# EAGLE design PogoFTDI (EAGLE 7.6.0)
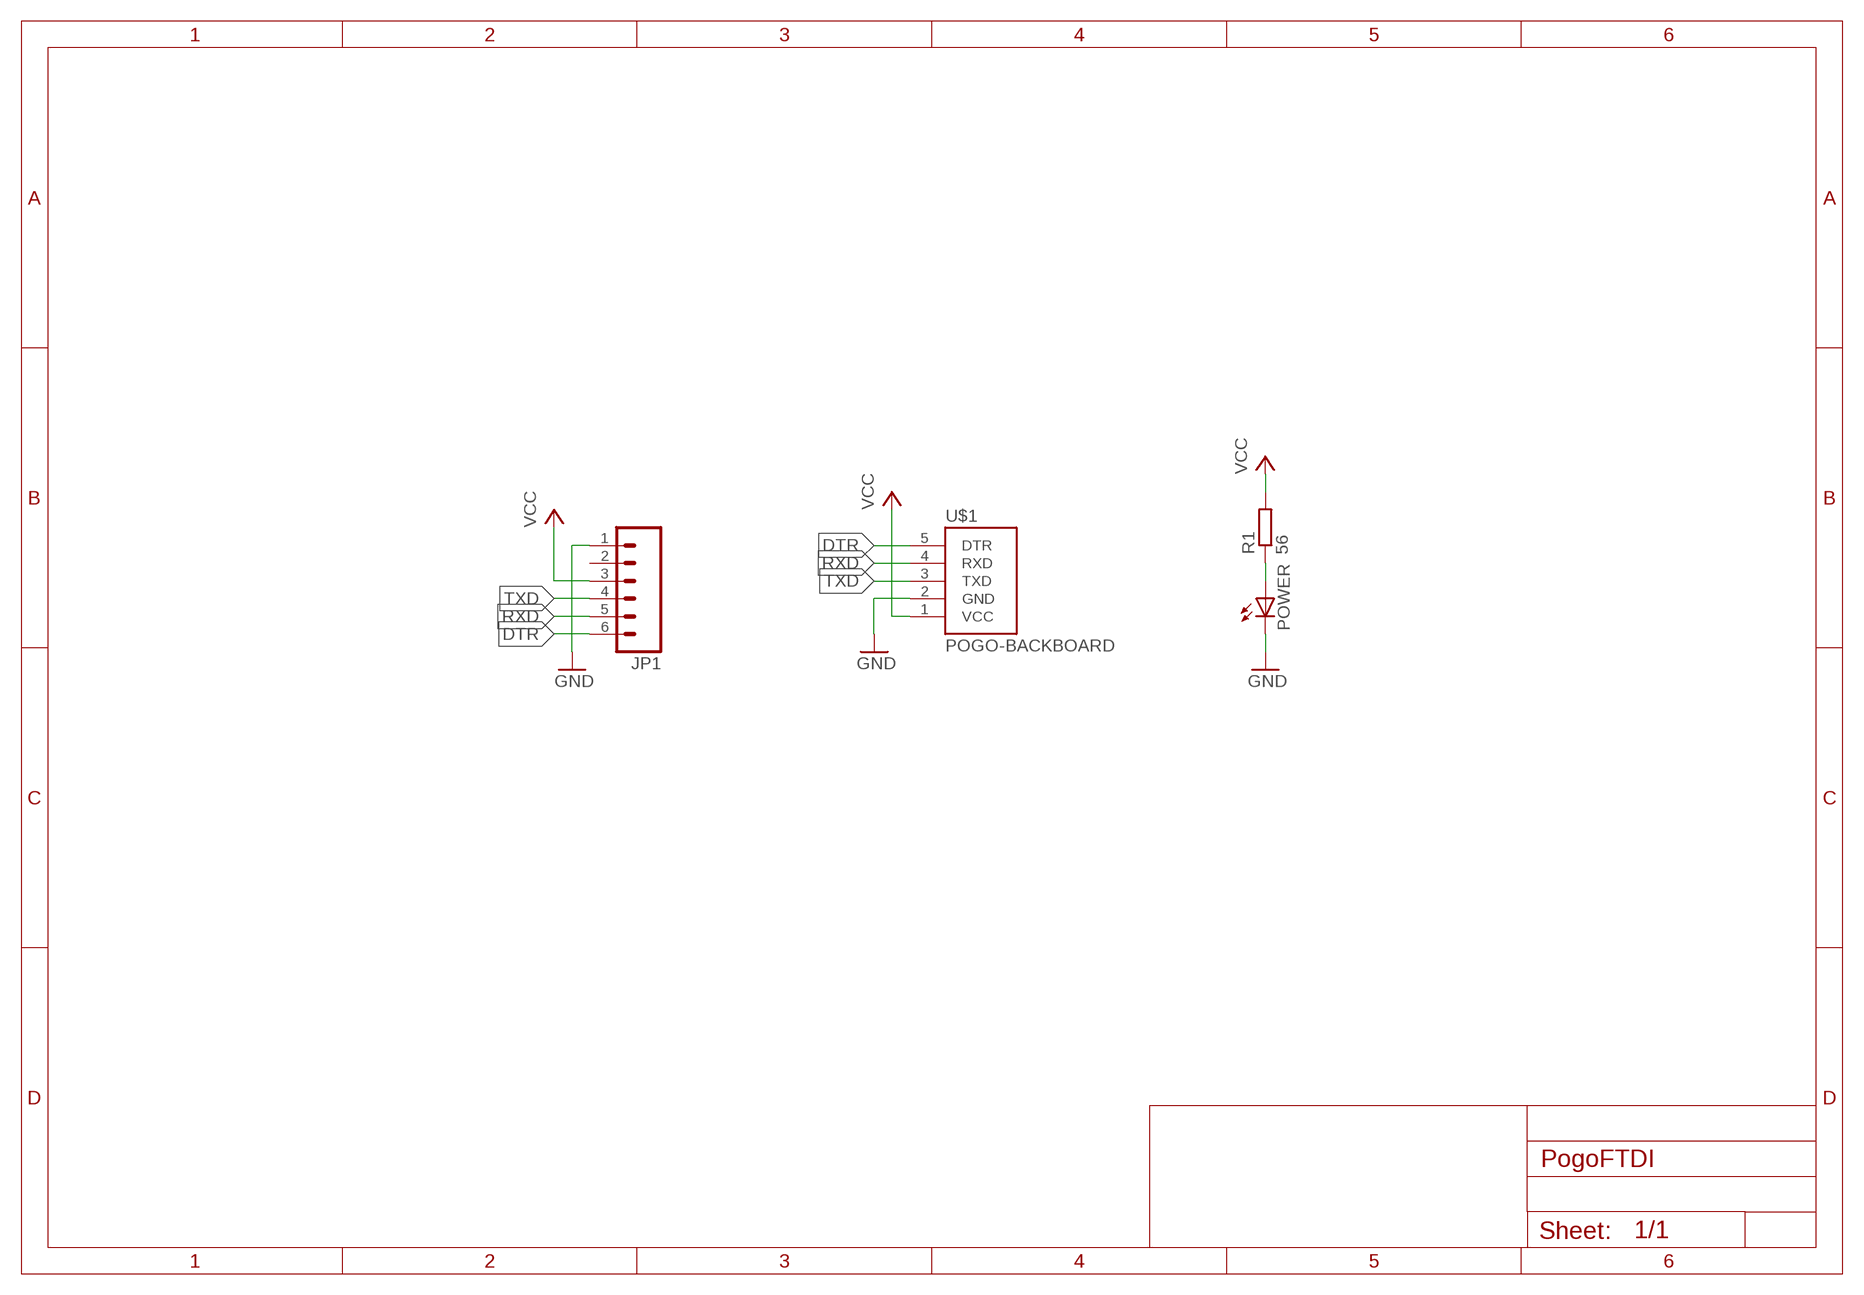
[diagram p0: schematic, sheet 1]

## Parts
JP1  M06SIP  [1X06]
POWER  LEDCHIPLED_0603  [CHIPLED_0603]
R1  56  R-EU_R0603  [R0603]
U$1  POGO-BACKBOARD  [POGO5-BACKMOUNT]

## Nets
DTR: JP1.6 U$1.5(DTR)
GND: JP1.1 POWER.C U$1.2(GND)
N$1: POWER.A R1.1
RXD: JP1.5 U$1.4(RXD)
TXD: JP1.4 U$1.3(TXD)
VCC: JP1.3 R1.2 U$1.1(VCC)
Unconnected: JP1.2

## Library data of the parts
JP1 = SparkFun:M06: Header 6 Standard 6-pin 0.1" header. Use with straight break away headers (SKU : PRT-00116), right angle break away headers (PRT-00553), swiss pins (PRT-00743), machine pins (PRT-00117), and female headers (PRT-00115). Molex polarized connector foot print use with SKU : PRT-08094 with associated crimp pins and housings. NOTES ON THE VARIANTS LOCK and LOCK_LONGPADS... This footprint was designed to help hold the alignment of a through-hole component (i.e. 6-pin header) while soldering it into place. You may notice that each hole has been shifted either up or down by 0.005 of an inch from it's more standard position (which is a perfectly straight line). This slight alteration caused the pins (the squares in the middle) to touch the edges of the holes. Because they are alternating, it causes a "brace" to hold the component in place. 0.005 has proven to be the perfect amount of "off-center" position when using our standard breakaway headers. Although looks a little odd when you look at the bare footprint, once you have a header in there, the alteration is very hard to notice. Also, if you push a header all the way into place, it is covered up entirely on the bottom side. This idea of altering the position of holes to aid alignment will be further integrated into the Sparkfun Library for other footprints. It can help hold any component with 3 or more connection pins.
POWER = adafruit:LED: LED OSRAM: - CHIPLED LG R971, LG N971, LY N971, LG Q971, LY Q971, LO R971, LY R971 LH N974, LH R974 LS Q976, LO Q976, LY Q976 LO Q996 - Hyper CHIPLED LW Q18S LB Q993, LB Q99A, LB R99A - SideLED LS A670, LO A670, LY A670, LG A670, LP A670 LB A673, LV A673, LT A673, LW A673 LH A674 LY A675 LS A676, LA A676, LO A676, LY A676, LW A676 LS A679, LY A679, LG A679 - Hyper Micro SIDELED® LS Y876, LA Y876, LO Y876, LY Y876 LT Y87S - SmartLED LW L88C, LW L88S LB L89C, LB L89S, LG L890 LS L89K, LO L89K, LY L89K LS L896, LA L896, LO L896, LY L896 - TOPLED LS T670, LO T670, LY T670, LG T670, LP T670 LSG T670, LSP T670, LSY T670, LOP T670, LYG T670 LG T671, LOG T671, LSG T671 LB T673, LV T673, LT T673, LW T673 LH T674 LS T676, LA T676, LO T676, LY T676, LB T676, LH T676, LSB T676, LW T676 LB T67C, LV T67C, LT T67C, LS T67K, LO T67K, LY T67K, LW E67C LS E67B, LA E67B, LO E67B, LY E67B, LB E67C, LV E67C, LT E67C LW T67C LS T679, LY T679, LG T679 LS T770, LO T770, LY T770, LG T770, LP T770 LB T773, LV T773, LT T773, LW T773 LH T774 LS E675, LA E675, LY E675, LS T675 LS T776, LA T776, LO T776, LY T776, LB T776 LHGB T686 LT T68C, LB T68C - Hyper Mini TOPLED® LB M676 - Mini TOPLED Santana® LG M470 LS M47K, LO M47K, LY M47K Source: http://www.osram.convergy.de/
R1 = rcl:R-EU_: RESISTOR, European symbol
U$1 = pogopin:POGO-BACKBOARD

## Board
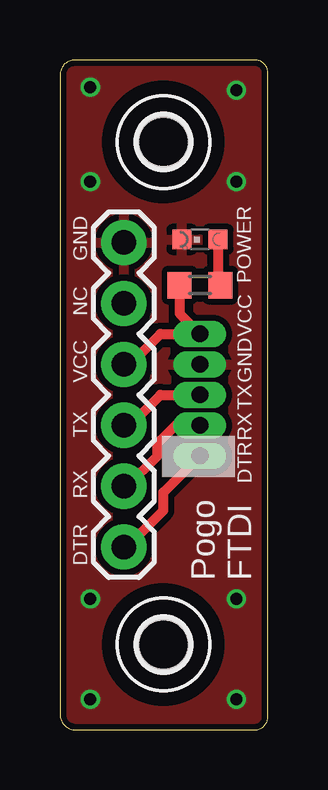
[diagram p1: board, top side]
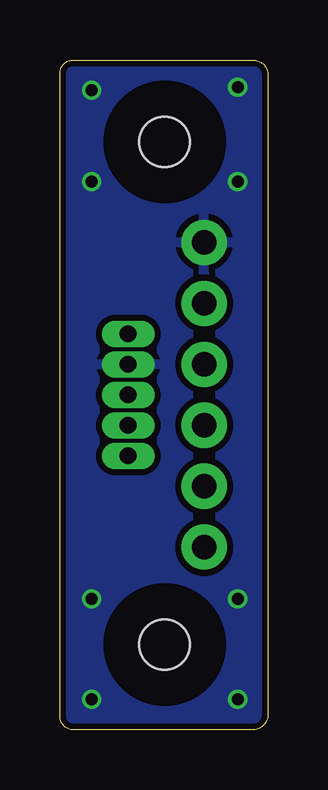
[diagram p2: board, bottom side, seen from below]

Size 8.69 x 27.93 mm. Coordinates in mm from the lower left corner, seen from the top.
Outline: 8.69,0.56 8.69,27.37 arc90 8.13,27.93 0.63,27.93 arc90 0,27.3 0,0.65 arc90 0.65,0 8.13,0 arc90 8.69,0.56
Copper layers (1*16): Top 0.035mm / dielectric 1.5mm / Bottom 0.035mm
Design rules "dirt_cheap_dirty_boards.v1 *": minimum track width 5mil, minimum drill 12mil, track to track 5mil, track to pad 5mil, pad to pad 5mil, via to via 5mil, smd to smd 0mil, copper to edge 10mil, drill to drill 10mil, minimum pad ring 8mil, minimum via ring 6mil, stop-mask expansion 2mil, vias tented up to drill 25mil, thermal gap 10mil

### Footprints (pad centres in the part's own frame; a part is rotated, then mirrored left to right if it is on the bottom)
1X06 = drill 1.016 pad 1.88: 1 0,0; 2 2.54,0; 3 5.08,0; 4 7.62,0; 5 10.16,0; 6 12.7,0
CHIPLED_0603 = smd 0.8 x 0.8: A 0,-0.75; C 0,0.75
R0603 = smd 1 x 1.1: 1 -0.85,0; 2 0.85,0
POGO5-BACKMOUNT = drill 0.7 long: 1 0,5.08; 2 0,3.81; 3 0,2.54; 4 0,1.27; 5 0,0
HOLE_M2PAN_TIGHT = hole 2.1: 0,0

### Placement (x,y rotation side)
JP1  2.67,20.32 270 top
POWER  5.84,20.45 90 top
R1  5.84,18.54 180 top
U$1  5.84,11.43 0 top
U$2  [HOLE_M2PAN_TIGHT]  4.32,24.51 0 top
U$3  [HOLE_M2PAN_TIGHT]  4.32,3.56 0 top

### Tracks (layer width: path | path; a pad name or v marks a point on that pad's centre or on a via)
DTR
  Top 0.406: JP1.6 2.79,7.62 4.32,9.14 4.32,9.91 U$1.5
GND  (via drill 0.5)
  other vias: 1.27,5.46 7.37,5.46 1.27,1.27 7.37,1.27 1.27,22.86 7.37,22.86 7.37,26.67 1.27,26.8
  pour Top (isolate 0.254): -1.78,28.83 9.53,28.83 9.53,-1.02 -1.78,-1.02
  pour Bottom (isolate 0.254): -1.65,28.7 9.53,28.7 9.53,-1.02 -1.65,-1.02
N$1
  Top 0.406: POWER.A 6.59,18.64 R1.1
RXD
  Top 0.406: JP1.5 2.79,10.16 4.06,11.43 4.06,11.94 4.83,12.7 U$1.4
TXD
  Top 0.406: JP1.4 2.92,12.7 4.19,13.97 U$1.3
VCC
  Top 0.406: R1.2 4.99,17.36 U$1.1 4.19,16.51 2.92,15.24 JP1.3

### Text on the board
tNames: GND | NC | VCC | VCC | GND | TX | TX | RX | RX | DTR | DTR | Pogo / FTDI